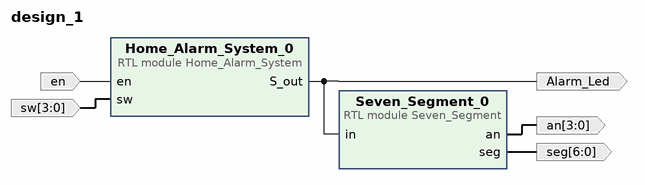
[diagram p0: block diagram of the top level]
# Vivado block design design_1, xc7a35tcpg236-1, Vivado 2021.1
create_bd_design design_1

create_bd_port -dir I -from 3 -to 0 sw
create_bd_port -dir I en
create_bd_port -dir O -from 6 -to 0 seg
create_bd_port -dir O -from 3 -to 0 an
create_bd_port -dir O Alarm_Led

create_bd_cell -type module -reference Home_Alarm_System Home_Alarm_System_0
create_bd_cell -type module -reference Seven_Segment Seven_Segment_0

# ---- connections ----

connect_bd_net [get_bd_pins Home_Alarm_System_0/S_out] [get_bd_ports Alarm_Led] [get_bd_pins Seven_Segment_0/in]
connect_bd_net [get_bd_pins Seven_Segment_0/an] [get_bd_ports an]
connect_bd_net [get_bd_pins Seven_Segment_0/seg] [get_bd_ports seg]
connect_bd_net [get_bd_ports en] [get_bd_pins Home_Alarm_System_0/en]
connect_bd_net [get_bd_ports sw] [get_bd_pins Home_Alarm_System_0/sw]

validate_bd_design
save_bd_design
